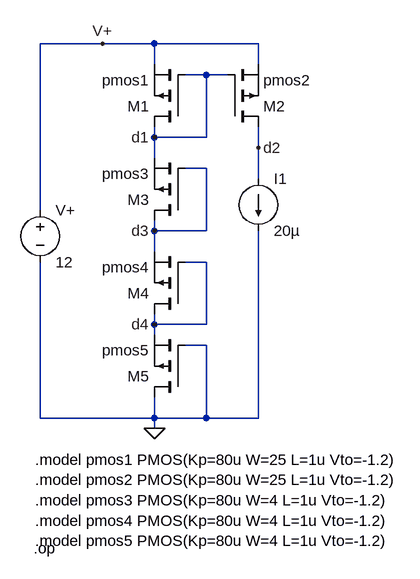
[diagram p0: schematic 14-10-8-b-1.asc]
14-10-8-b-1.asc, the LTspice schematic file:
Version 4
SHEET 1 880 680
WIRE -112 -240 -208 -240
WIRE -32 -240 -112 -240
WIRE 128 -240 -32 -240
WIRE -32 -208 -32 -240
WIRE 128 -208 128 -240
WIRE 48 -192 16 -192
WIRE 80 -192 48 -192
WIRE -32 -96 -32 -112
WIRE 48 -96 48 -192
WIRE 48 -96 -32 -96
WIRE 128 -80 128 -112
WIRE -32 -64 -32 -96
WIRE 48 -48 16 -48
WIRE 128 -32 128 -80
WIRE -208 16 -208 -240
WIRE -32 48 -32 32
WIRE 48 48 48 -48
WIRE 48 48 -32 48
WIRE -32 80 -32 48
WIRE 48 96 16 96
WIRE -32 192 -32 176
WIRE 48 192 48 96
WIRE 48 192 -32 192
WIRE -32 208 -32 192
WIRE 48 224 16 224
WIRE -208 336 -208 96
WIRE -32 336 -32 304
WIRE -32 336 -208 336
WIRE 48 336 48 224
WIRE 48 336 -32 336
WIRE 128 336 128 48
WIRE 128 336 48 336
WIRE -32 352 -32 336
FLAG -32 352 0
FLAG -112 -240 V+
FLAG -32 -96 d1
FLAG 128 -80 d2
FLAG -32 48 d3
FLAG -32 192 d4
SYMBOL pmos 16 -112 R180
SYMATTR InstName M1
SYMATTR Value pmos1
SYMBOL pmos 80 -112 M180
SYMATTR InstName M2
SYMATTR Value pmos2
SYMBOL pmos 16 32 R180
SYMATTR InstName M3
SYMATTR Value pmos3
SYMBOL pmos 16 176 R180
SYMATTR InstName M4
SYMATTR Value pmos4
SYMBOL pmos 16 304 R180
SYMATTR InstName M5
SYMATTR Value pmos5
SYMBOL voltage -208 0 R0
WINDOW 123 0 0 Left 0
WINDOW 39 0 0 Left 0
SYMATTR InstName V+
SYMATTR Value 12
SYMBOL current 128 -32 R0
WINDOW 123 0 0 Left 0
WINDOW 39 0 0 Left 0
SYMATTR InstName I1
SYMATTR Value 20µ
TEXT -216 400 Left 2 !.model pmos1 PMOS(Kp=80u W=25 L=1u Vto=-1.2)\n.model pmos2 PMOS(Kp=80u W=25 L=1u Vto=-1.2)\n.model pmos3 PMOS(Kp=80u W=4 L=1u Vto=-1.2)\n.model pmos4 PMOS(Kp=80u W=4 L=1u Vto=-1.2)\n.model pmos5 PMOS(Kp=80u W=4 L=1u Vto=-1.2)
TEXT -218 536 Left 2 !.op

The netlist it stands for:
* 14-10-8-b-1.asc
M1 d1 d1 V+ V+ pmos1
M2 d2 d1 V+ V+ pmos2
M3 d3 d3 d1 d1 pmos3
M4 d4 d4 d3 d3 pmos4
M5 0 0 d4 d4 pmos5
V+ V+ 0 12
I1 d2 0 20µ
.model NMOS NMOS
.model PMOS PMOS
.lib standard.mos
.model pmos1 PMOS(Kp=80u W=25 L=1u Vto=-1.2)
.model pmos2 PMOS(Kp=80u W=25 L=1u Vto=-1.2)
.model pmos3 PMOS(Kp=80u W=4 L=1u Vto=-1.2)
.model pmos4 PMOS(Kp=80u W=4 L=1u Vto=-1.2)
.model pmos5 PMOS(Kp=80u W=4 L=1u Vto=-1.2)
.op
.backanno
.end